# Altium schematic sheet Sheet1.SchDoc
size A
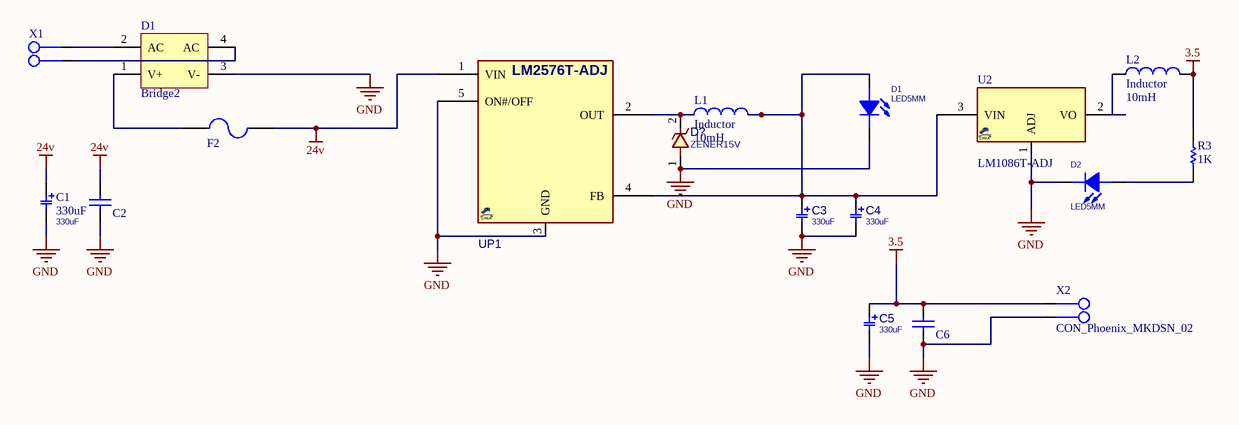
[diagram p0: Sheet1.SchDoc]

## Parts
(Parts that share a designator on the sheet are numbered #1, #2 ... from top to bottom, then left to right.)
C1  330uF  [C_EL_8X12]
C2  (no value)  [CBB22]
C3  330uF  [C_EL_8X12]
C4  330uF  [C_EL_8X12]
C5  330uF  [C_EL_8X12]
C6  (no value)  [CBB22]
D1#1  Bridge2  [D-46_6A]
D1#2  LED5MM  [LED5MM_BLUE]
D2  LED5MM  [LED5MM_BLUE]
D?  ZENER15V  [D_AX04_DO41]
F2  F=1.0 A  [Fuse 5x20 With holder pin]  (value not drawn)
L1  Inductor  value 10mH  [INDC4532]
L2  Inductor  value 10mH  [INDC4532]
R3  1K  [Axial 1W  7_0mm]
U2  LM1086T-ADJ  [TO220_3]
UP1  LM2576HVT-ADJ  [TO220_5]  (value not drawn)
X1  CON_Phoenix_MKDSN_02  [CON_MKDSN1,5/2-5,08]  (value not drawn)
X2  CON_Phoenix_MKDSN_02  [CON_MKDSN1,5/2-5,08]

## Nets
3.5: C5.1 C6.2 L2.2 R3.1 X2.1
24v: C1.1 C2.2 F2.2 UP1.1(VIN)
GND: C1.2 C2.1 C3.2 C4.2 C5.2 C6.1 D1#1.3(V-) D1#2.2(CATHODE) D2.2(CATHODE) D?.1 U2.1(ADJ) UP1.3(GND) UP1.5(ON#/OFF) X2.2
NetC3_1: C3.1 C4.1 D1#2.1(ANODE) L1.2 U2.3(VIN) UP1.4(FB)
NetD1#1_1: D1#1.1(V+) F2.1
NetD1#1_2: D1#1.2(AC) X1.1
NetD1#1_4: D1#1.4(AC) X1.2
NetD2_1: D2.1(ANODE) R3.2
NetD?_2: D?.2 L1.1 UP1.2(OUT)
NetL2_1: L2.1 U2.2(VO)

## Notes on the sheet
- (in symbol VREG_LM2576HVT-ADJ) LM2576T-ADJ

## Library data of the parts
C1 C3-C5 = CAP_THD_EL_330u25V: CAP, THD, ELEC, 330uF, 25V; MANF_P#: EEE-1EA331UP; PARAM2: 20%; MANF: PANASONIC; DESC: DESCRIPTION; DIST#: MOUSER; PRICE: 10= 5$; ASSEMBLY: ASSEMBLY; PARAM: 25V; VALUE: 330uF
C2 C6 = Cap CBB22 105J400V: Polypropylene film with epoxy Cap CBB22 105J400V; Manufacturer: CHINA; Designer: Abbas Basereh; Data: 16-12-2016; Link: https://www.alibaba.com/product-detail/CBB22-capacitors-105J-400V-1UF-400V_60020643516.html; Part. No: 105J400V
D1#1 = Bridge2: Diode Bridge; Published: 24-Mar-1999; LatestRevisionDate: 17-Jul-2002; LatestRevisionNote: Re-released for DXP Platform.; PackageReference: D-46_6A; Publisher: Altium Limited; PackageDescription: Bridge Rectifier; 4 Terminals; Body 16.8 x 16.8 mm (typ); Pitch 10.67 mm
D1#2 D2 = LED5MM: LED LIGHTING; Designer: Abbas Basereh; Data: 16-12-2016; Link: *; Part.No: *
D? = DIODE_THD_ZENER: DIODE, ZENER, 0.2W, 15V; MANF: Diodes; DESC: DESCRIPTION; ASSEMBLY: ASSEMBLY; PRICE: PRICE; PARAM2: 0.2W; PARAM: 15V; MANF_P#: ZENER15V; VALUE: ZENER15V
F2 = Fuse 5x20 with holdeer pins: Fuses 5x20; Designer: Abbas Basereh; Desc.: fuse with holder pins 5x20; Data: 28-12-2016
L1 L2 = Inductor: Code_IEC: 1005; Published: 8-Jun-2000; LatestRevisionDate: 29-May-2009; LatestRevisionNote: IPC-7351 Footprint Added.; PackageReference: 0402-A; Publisher: Altium Limited; PackageDescription: Chip Inductor; Code_JEITA: 0402
R3 = RES Axial 1W: Designer: Abbas Basereh; Desc.: RES Axial 1W; Data: 4-1-2017
U2 = VREG_1086_TO220: REG, Linear, LDO1.3, Adj, 1.5A, TO-220; MANF_P#: LM1086IT-ADJ, LD1086VY, LD1086V-DG, LM1086CT-ADJ; MANF: TI, ST; PARAM2: 2.8~30VIN, 1.3VDROP, 1.25VREF; PARAM: 1.5A; VALUE: LM1086T-ADJ
UP1 = VREG_LM2576HVT-ADJ: REG, Switching, Buck, 3A, ADJ, 50KHz, HV, TO-220; MANF: TI, ON, HTC, MICROCHIP; PARAM: 3A, ADJ; PARAM2: 50KHz, 60VIN; ASSEMBLY: ASSEMBLY; PRICE: PRICE; DESC: REG, Switching, Buck, 3A, ADJ, 50KHz, HV, TO-220; MANF_P#: LM2576HVT-ADJ; VALUE: LM2576HVT-ADJ
X1 X2 = CON_Phoenix_MKDSN_02: Manufacturer: PHOENIX CONTACT; Company: SJ Libraries; Connector type: PCB Terminal Block; designer: Eng. Saeid Jorablo; Max Current: 13.5 A; Positions: 2; Revision 1: 2012/10/1 : Adding Model; Voltage: 400 V; Category: Connector; ComponentLink1Description: Datasheet; ComponentLink2Description: Reference; HelpURL: http://s3.picofile.com/file/7443264187/Coming_Soon_logo.gif; Mounting Technology: Through-Hole; Pin Count: 2; Publisher: SJ UnLimited; Status: Unreleased; Update: 2012/10/1